# EAGLE schematic B_OTL_PSU_Board_REV_A (EAGLE 9.6.2)
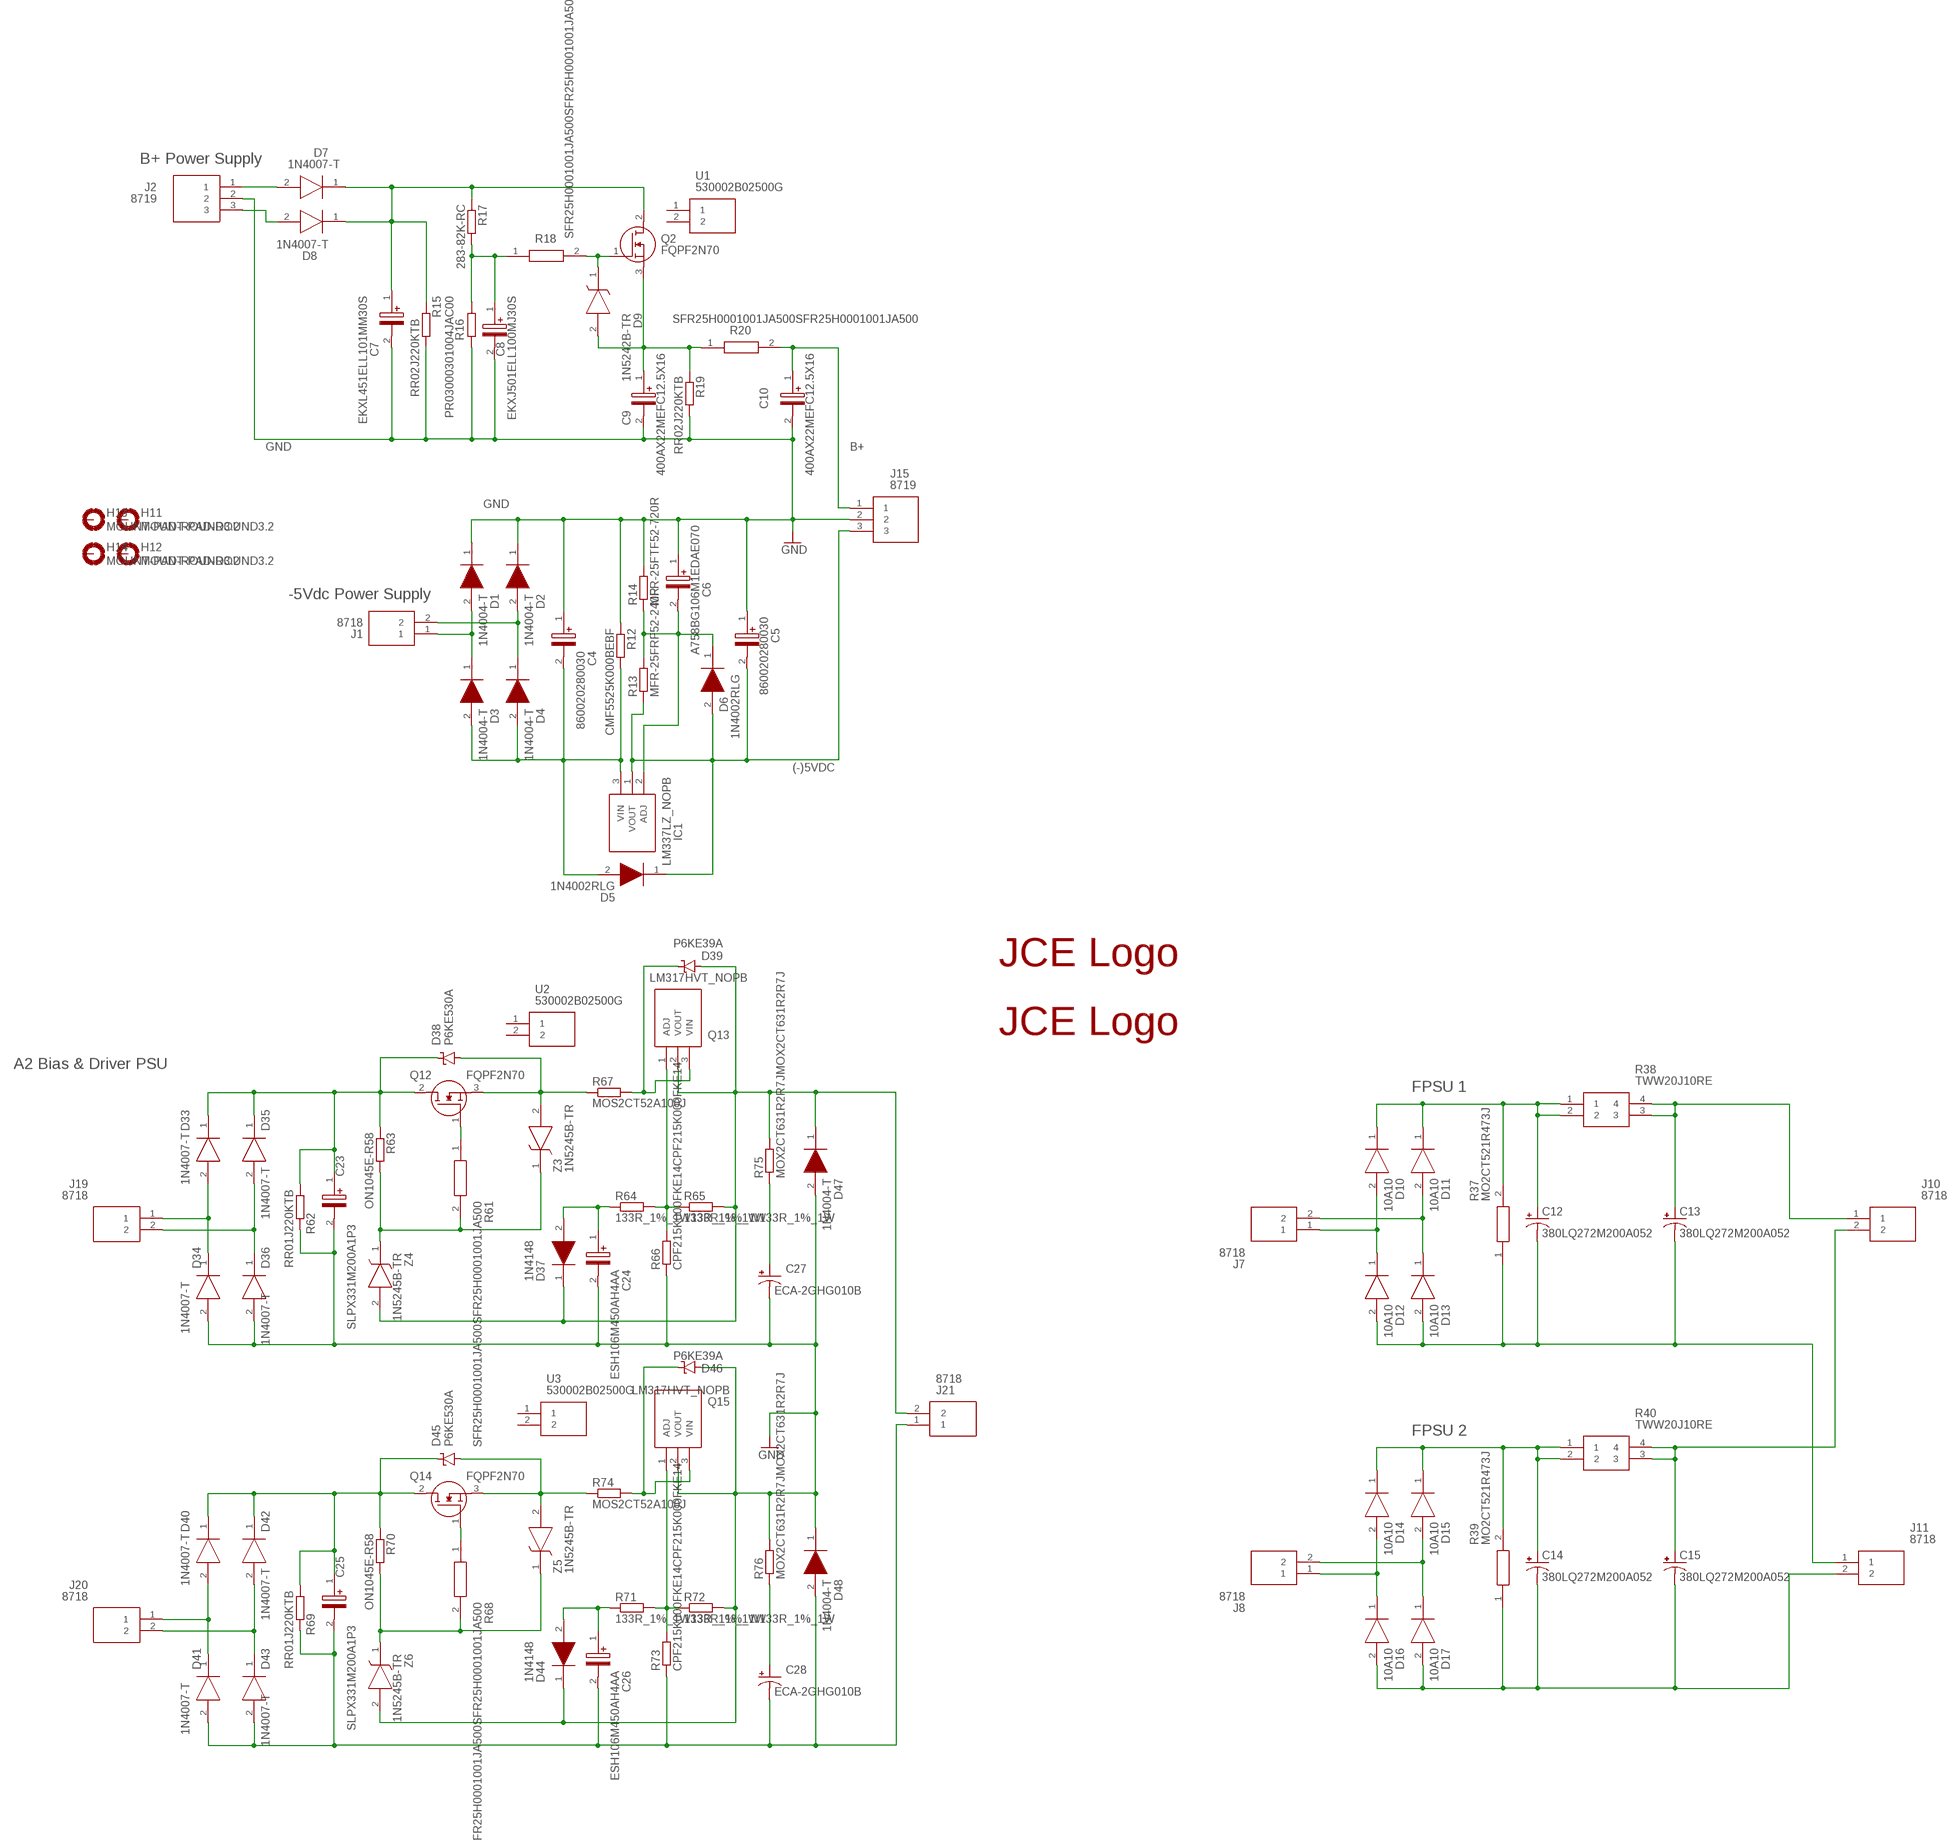
[diagram p0: schematic, sheet 1]

## Parts
C4  860020280030  [CAPPRD750W82D1600H3550]
C5  860020280030  [CAPPRD750W82D1600H3550]
C6  A758BG106M1EDAE070  [CAPPRD200W55D500H800]
C7  EKXL451ELL101MM30S  [CAPPRD750W80D1825H3200]
C8  EKXJ501ELL100MJ30S  [CAPPRD500W60D1025H3150]
C9  400AX22MEFC12.5X16  [CAPPRD500W60D1250H1600]
C10  400AX22MEFC12.5X16  [CAPPRD500W60D1250H1600]
C12  380LQ272M200A052  [CAPPRD1000W210D3550H5200]
C13  380LQ272M200A052  [CAPPRD1000W210D3550H5200]
C14  380LQ272M200A052  [CAPPRD1000W210D3550H5200]
C15  380LQ272M200A052  [CAPPRD1000W210D3550H5200]
C23  SLPX331M200A1P3  [CAPPRD1000W190D2250H2700]
C24  ESH106M450AH4AA  [CAPPRD500W60D1000H2200]
C25  SLPX331M200A1P3  [CAPPRD1000W190D2250H2700]
C26  ESH106M450AH4AA  [CAPPRD500W60D1000H2200]
C27  ECA-2GHG010B  [CAPPRD500W60D630H1120B]
C28  ECA-2GHG010B  [CAPPRD500W60D630H1120B]
D1  1N4004-T  [DIOAD1408W86L464D236]
D2  1N4004-T  [DIOAD1408W86L464D236]
D3  1N4004-T  [DIOAD1408W86L464D236]
D4  1N4004-T  [DIOAD1408W86L464D236]
D5  1N4002RLG  [DIOAD1138W86L465D235B]
D6  1N4002RLG  [DIOAD1138W86L465D235B]
D7  1N4007-T  [DIOAD1408W86L464D236]
D8  1N4007-T  [DIOAD1408W86L464D236]
D9  1N5242B-TR  [DIOAD700W55L350D160B]
D10  10A10  [DIOAD1910W130L885D885B]
D11  10A10  [DIOAD1910W130L885D885B]
D12  10A10  [DIOAD1910W130L885D885B]
D13  10A10  [DIOAD1910W130L885D885B]
D14  10A10  [DIOAD1910W130L885D885B]
D15  10A10  [DIOAD1910W130L885D885B]
D16  10A10  [DIOAD1910W130L885D885B]
D17  10A10  [DIOAD1910W130L885D885B]
D33  1N4007-T  [DIOAD1408W86L464D236]
D34  1N4007-T  [DIOAD1408W86L464D236]
D35  1N4007-T  [DIOAD1408W86L464D236]
D36  1N4007-T  [DIOAD1408W86L464D236]
D37  1N4148  [DIOAD1068W53L380D172]
D38  P6KE530A  [DIOAD1378W86L670D310B]
D39  P6KE39A  [DIOAD1299W88L640D324B]
D40  1N4007-T  [DIOAD1408W86L464D236]
D41  1N4007-T  [DIOAD1408W86L464D236]
D42  1N4007-T  [DIOAD1408W86L464D236]
D43  1N4007-T  [DIOAD1408W86L464D236]
D44  1N4148  [DIOAD1068W53L380D172]
D45  P6KE530A  [DIOAD1378W86L670D310B]
D46  P6KE39A  [DIOAD1299W88L640D324B]
D47  1N4004-T  [DIOAD1408W86L464D236]
D48  1N4004-T  [DIOAD1408W86L464D236]
H11  MOUNT-PAD-ROUND3.2  [3,2-PAD]
H12  MOUNT-PAD-ROUND3.2  [3,2-PAD]
H13  MOUNT-PAD-ROUND3.2  [3,2-PAD]
H14  MOUNT-PAD-ROUND3.2  [3,2-PAD]
IC1  LM337LZ_NOPB  [LM337LZNOPB]
J1  8718  [SHDR2W99P0X500_1X2_1001X762X10]
J2  8719  [8719]
J7  8718  [SHDR2W99P0X500_1X2_1001X762X10]
J8  8718  [SHDR2W99P0X500_1X2_1001X762X10]
J10  8718  [SHDR2W99P0X500_1X2_1001X762X10]
J11  8718  [SHDR2W99P0X500_1X2_1001X762X10]
J15  8719  [8719]
J19  8718  [SHDR2W99P0X500_1X2_1001X762X10]
J20  8718  [SHDR2W99P0X500_1X2_1001X762X10]
J21  8718  [SHDR2W99P0X500_1X2_1001X762X10]
Q2  FQPF2N70  [TO254P490X1016X1977-3P]
Q12  FQPF2N70  [TO254P490X1016X1977-3P]
Q13  LM317HVT_NOPB  [TO254P470X1028X1955-3P]
Q14  FQPF2N70  [TO254P490X1016X1977-3P]
Q15  LM317HVT_NOPB  [TO254P470X1028X1955-3P]
R12  CMF5525K000BEBF  [RESAD999W69L610D229B]
R13  MFR-25FRF52-240R  [RESAD1000W60L630D230B]
R14  MFR-25FTF52-720R  [RESAD1000W60L630D230B]
R15  RR02J220KTB  [RESAD1630W90L900D350B]
R16  PR03000301004JAC00  [RESAD2276W63L1950D520B]
R17  283-82K-RC  [RESAD1950W75L1600D550B]
R18  SFR25H0001001JA500SFR25H0001001JA500  [RESAD1076W63L700D250B]
R19  RR02J220KTB  [RESAD1630W90L900D350B]
R20  SFR25H0001001JA500SFR25H0001001JA500  [RESAD1076W63L700D250B]
R37  MO2CT521R473J  [RESAD3950W80L1550D600]
R38  TWW20J10RE  [TWW20J10RE]
R39  MO2CT521R473J  [RESAD3950W80L1550D600]
R40  TWW20J10RE  [TWW20J10RE]
R61  SFR25H0001001JA500SFR25H0001001JA500  [RESAD1076W63L700D250B]
R62  RR01J220KTB  [RESAD1110W65L680D260B]
R63  ON1045E-R58  [ON1045E-R58]
R64  133R_1%_1W133R_1%_1W  [RESAD1560W50L1230D250B]
R65  133R_1%_1W133R_1%_1W  [RESAD1560W50L1230D250B]
R66  CPF215K000FKE14CPF215K000FKE14  [RESAD1683W81L1080D368B]
R67  MOS2CT52A100J  [RESAD1660W80L1200D400B]
R68  SFR25H0001001JA500SFR25H0001001JA500  [RESAD1076W63L700D250B]
R69  RR01J220KTB  [RESAD1110W65L680D260B]
R70  ON1045E-R58  [ON1045E-R58]
R71  133R_1%_1W133R_1%_1W  [RESAD1560W50L1230D250B]
R72  133R_1%_1W133R_1%_1W  [RESAD1560W50L1230D250B]
R73  CPF215K000FKE14CPF215K000FKE14  [RESAD1683W81L1080D368B]
R74  MOS2CT52A100J  [RESAD1660W80L1200D400B]
R75  MOX2CT631R2R7JMOX2CT631R2R7J  [RESAD2010W80L1550D650B]
R76  MOX2CT631R2R7JMOX2CT631R2R7J  [RESAD2010W80L1550D650B]
SYM1  JCE_SMALLSMALL  [JCE_SMALL]
SYM2  JCE  [JCE]
U1  530002B02500G  [529802B02500G]
U2  530002B02500G  [529802B02500G]
U3  530002B02500G  [529802B02500G]
Z3  1N5245B-TR  [DIOAD990W55L350D160]
Z4  1N5245B-TR  [DIOAD990W55L350D160]
Z5  1N5245B-TR  [DIOAD990W55L350D160]
Z6  1N5245B-TR  [DIOAD990W55L350D160]

## Nets
(+)FPSU_1: C13.1(+) J10.1 R38.3 R38.4
(+)FPSU_2: C15.1(+) J10.2 R40.3 R40.4
(-)5VDC: C5.2(-) D5.1(K) D6.2(A) IC1.1(VOUT) J15.3 R13.1
(-)FPSU_1: C12.2(-) C13.2(-) D12.2(A) D13.2(A) J11.1 R37.1
(-)FPSU_2: C14.2(-) C15.2(-) D16.2(A) D17.2(A) J11.2 R39.1
B+: C10.1(+) J15.1 R20.2
GND: C4.1(+) C5.1(+) C6.1(+) C7.2(-) C8.2(-) C9.2(-) C10.2(-) C23.2(-) C24.2(-) C27.2(-) D1.1(K) D2.1(K) D34.2(A) D36.2(A) D44.1(K) D46.2(A) D47.2(A) D48.1(K) J2.2 J15.2 Q15.2(VOUT) R12.1 R14.2 R15.2 R16.2 R19.2 R62.2 R66.1 R72.2 R76.2 Z6.2(A)
N$1: D33.2(A) D34.1(K) J19.1
N$2: C23.1(+) D33.1(K) D35.1(K) D38.1(C) Q12.2(D) R62.1 R63.1
N$4: D35.2(A) D36.1(K) J19.2
N$5: C24.1(+) D37.2(A) R64.1
N$6: Q12.1(G) R61.1
N$7: R61.2 R63.2 Z3.1(K) Z4.1(K)
N$8: D38.2(A) Q12.3(S) R67.1 Z3.2(A)
N$9: D39.1(C) Q13.3(VIN) R67.2
N$10: D1.2(A) D3.1(K) J1.1
N$13: Q13.1(ADJ) R64.2 R65.1 R66.2
N$16: D2.2(A) D4.1(K) J1.2
N$17: D7.2(A) J2.1
N$18: C4.2(-) D3.2(A) D4.2(A) D5.2(A) IC1.3(VIN) R12.2
N$19: C6.2(-) D6.1(K) IC1.2(ADJ) R13.2 R14.1
N$20: D8.2(A) J2.3
N$21: C7.1(+) D7.1(K) D8.1(K) Q2.2(D) R15.1 R17.1
N$22: C8.1(+) R16.1 R17.2 R18.1
N$23: C25.1(+) D40.1(K) D42.1(K) D45.1(C) Q14.2(D) R69.1 R70.1
N$24: D9.1(K) Q2.1(G) R18.2
N$25: C9.1(+) D9.2(A) Q2.3(S) R19.1 R20.1
N$32: C26.1(+) D44.2(A) R71.1
N$38: Q15.1(ADJ) R71.2 R72.1 R73.2
N$42: Q14.1(G) R68.1
N$45: R68.2 R70.2 Z5.1(K) Z6.1(K)
N$49: D45.2(A) Q14.3(S) R74.1 Z5.2(A)
N$54: D46.1(C) Q15.3(VIN) R74.2
N$58: C12.1(+) D10.1(K) D11.1(K) R37.2 R38.1 R38.2
N$61: D11.2(A) D13.1(K) J7.2
N$62: D10.2(A) D12.1(K) J7.1
N$63: C14.1(+) D14.1(K) D15.1(K) R39.2 R40.1 R40.2
N$65: D15.2(A) D17.1(K) J8.2
N$66: D14.2(A) D16.1(K) J8.1
N$87: C28.1(+) R76.1
N$88: D40.2(A) D41.1(K) J20.1
N$89: C27.1(+) R75.1
N$90: D42.2(A) D43.1(K) J20.2
V+: D37.1(K) D39.2(A) D47.1(K) J21.2 Q13.2(VOUT) R65.2 R75.2 Z4.2(A)
V-: C25.2(-) C26.2(-) C28.2(-) D41.2(A) D43.2(A) D48.2(A) J21.1 R69.2 R73.1
Unconnected: H11.B3,2(MOUNT) H12.B3,2(MOUNT) H13.B3,2(MOUNT) H14.B3,2(MOUNT) U1.1 U1.2 U2.1 U2.2 U3.1 U3.2

## Notes on the sheet
- B+ Power Supply
- -5Vdc Power Supply
- A2 Bias & Driver PSU
- FPSU 1
- FPSU 2

## Library data of the parts
C4 C5 = SamacSys_Parts:860020280030: Wurth Elektronik 12000uF 10 V dc Aluminium Electrolytic Capacitor, WCAP-ATG5 Series 2000h 16 (Dia.) x 35.5mm Source: Datasheet; DESCRIPTION: Wurth Elektronik 12000uF 10 V dc Aluminium Electrolytic Capacitor, WCAP-ATG5 Series 2000h 16 (Dia.) x 35.5mm; HEIGHT: 35.5mm; MANUFACTURER_NAME: Wurth Elektronik; MANUFACTURER_PART_NUMBER: 860020280030
C6 = SamacSys_Parts:A758BG106M1EDAE070: Aluminum Organic Polymer Capacitors 25V 10uF 20% ESR= 70mohms Source: Datasheet <https://api.kemet.com/component-edge/download/datasheet/A758BG106M1EDAE070.pdf>; DESCRIPTION: Aluminum Organic Polymer Capacitors 25V 10uF 20% ESR= 70mohms; HEIGHT: 8mm; MANUFACTURER_NAME: Kemet; MANUFACTURER_PART_NUMBER: A758BG106M1EDAE070; MOUSER_PART_NUMBER: 80-A758BG106M1EDAE70; MOUSER_PRICE-STOCK: https://www.mouser.co.uk/ProductDetail/KEMET/A758BG106M1EDAE070?qs=hzBznG4dWXUYIEcEuNBy%252BQ%3D%3D
C7 = SamacSys_Parts:EKXL451ELL101MM30S: Aluminum Electrolytic Capacitors - Radial Leaded 100uF 20% 450V Long Life Source: Datasheet <https://www.mouser.co.uk/datasheet/2/420/United-Chemi-Con-1511408.pdf>; DESCRIPTION: Aluminum Electrolytic Capacitors - Radial Leaded 100uF 20% 450V Long Life; HEIGHT: 32mm; MANUFACTURER_NAME: Chemi-Con; MANUFACTURER_PART_NUMBER: EKXL451ELL101MM30S; MOUSER_PART_NUMBER: 661-EKXL451ELL101MM3; MOUSER_PRICE-STOCK: https://www.mouser.co.uk/ProductDetail/United-Chemi-Con/EKXL451ELL101MM30S?qs=r5DSvlrkXmK%252B3Zyx4Rj%2FlA%3D%3D
C8 = SamacSys_Parts:EKXJ501ELL100MJ30S: Aluminum Electrolytic Capacitors - Radial Leaded 10uF 500V 20% Aluminum Capacitor Source: Datasheet <https://www.mouser.com/datasheet/2/420/113326760852d6c4ba03a36-1218575.pdf>; DESCRIPTION: Aluminum Electrolytic Capacitors - Radial Leaded 10uF 500V 20% Aluminum Capacitor; HEIGHT: 31.5mm; MANUFACTURER_NAME: United Chemi-Con (UCC); MANUFACTURER_PART_NUMBER: EKXJ501ELL100MJ30S; MOUSER_PART_NUMBER: 661-EKXJ501ELL100MJ3
C9 C10 = SamacSys_Parts:400AX22MEFC12.5X16: Aluminium Electrolytic Capacitors - Radial Leaded GENERAL PURPOSE ELECTROLYTIC CAPACITORS Source: Datasheet <https://www.mouser.fr/datasheet/2/977/e_AX-1601119.pdf>; DESCRIPTION: Aluminium Electrolytic Capacitors - Radial Leaded GENERAL PURPOSE ELECTROLYTIC CAPACITORS; HEIGHT: 16mm; MANUFACTURER_NAME: Rubycon; MANUFACTURER_PART_NUMBER: 400AX22MEFC12.5X16; MOUSER_PART_NUMBER: 232-400AX22MEFC125X1; MOUSER_PRICE-STOCK: https://www.mouser.co.uk/ProductDetail/Rubycon/400AX22MEFC125X16?qs=T3oQrply3y%2FIK5H7GYNKdQ%3D%3D
C12-C15 = SamacSys_Parts:380LQ272M200A052: Cornell-Dubilier 2700uF 200 V dc Aluminium Capacitor A05, 380LQ Series 1000 (Shelf) h, 2000 (Endurance) h 35 x 50mm Source: Datasheet; DESCRIPTION: Cornell-Dubilier 2700uF 200 V dc Aluminium Capacitor A05, 380LQ Series 1000 (Shelf) h, 2000 (Endurance) h 35 x 50mm; HEIGHT: 52mm; MANUFACTURER_NAME: Cornell Dubilier; MANUFACTURER_PART_NUMBER: 380LQ272M200A052; MOUSER_PART_NUMBER: 5985-380-200V272; MOUSER_PRICE-STOCK: https://www.mouser.co.uk/ProductDetail/Cornell-Dubilier-CDE/380LQ272M200A052?qs=CL13mIxpkeFZi9XUnm6n7w%3D%3D
C23 C25 = SamacSys_Parts:SLPX331M200A1P3: Cap Aluminum Lytic 330uF 200V 20% (22 X 25mm) Snap-In 10mm 0.603 Ohm 1510mA 3000h 85C Source: Datasheet <https://www.arrow.com/en/products/slpx331m200a1p3/cornell-dubilier-electronics>; DESCRIPTION: Cap Aluminum Lytic 330uF 200V 20% (22 X 25mm) Snap-In 10mm 0.603 Ohm 1510mA 3000h 85C; HEIGHT: 27mm; MANUFACTURER_NAME: Cornell Dubilier; MANUFACTURER_PART_NUMBER: SLPX331M200A1P3
C24 C26 = SamacSys_Parts:ESH106M450AH4AA: KEMET - ESH106M450AH4AA - Electrolytic Capacitor, 10 F, 450 V, ESH Series, +/- 20%, Radial Leaded, 10 mm Source: Datasheet <https://ms.componentsearchengine.com/Datasheets/2/ESH106M450AH4AA.pdf>; DESCRIPTION: KEMET - ESH106M450AH4AA - Electrolytic Capacitor, 10 F, 450 V, ESH Series, +/- 20%, Radial Leaded, 10 mm; HEIGHT: 22mm; MANUFACTURER_NAME: Kemet; MANUFACTURER_PART_NUMBER: ESH106M450AH4AA
C27 C28 = SamacSys_Parts:ECA-2GHG010B: ECA-2GHG010B 1uF 400VDC 105C
D1-D4 D47 D48 = SamacSys_Parts:1N4004-T: Diodes Inc 400V 1A, Diode, 2-Pin DO-41 1N4004-T Source: Datasheet <https://www.diodes.com/assets/Datasheets/ds28002.pdf>; DESCRIPTION: Diodes Inc 400V 1A, Diode, 2-Pin DO-41 1N4004-T; HEIGHT: mm; MANUFACTURER_NAME: Diodes Inc.; MANUFACTURER_PART_NUMBER: 1N4004-T; MOUSER_PART_NUMBER: 621-1N4004; MOUSER_PRICE-STOCK: https://www.mouser.co.uk/ProductDetail/Diodes-Incorporated/1N4004-T/?qs=e%2FRqmsgwm9h5YfUmULbvEw%3D%3D
D5 D6 = SamacSys_Parts:1N4002RLG: Rectifiers 100V 1A Standard
D7 D8 D33-D36 D40-D43 = SamacSys_Parts:1N4007-T: Diode Standard 1A 1000V 1Vf DO41 Diodes Inc 1N4007-T, Switching Diode, 1000V 1A, 2-Pin DO-41 Source: Datasheet; DESCRIPTION: Diode Standard 1A 1000V 1Vf DO41 Diodes Inc 1N4007-T, Switching Diode, 1000V 1A, 2-Pin DO-41; HEIGHT: mm; MANUFACTURER_NAME: Diodes Inc.; MANUFACTURER_PART_NUMBER: 1N4007-T; MOUSER_PART_NUMBER: 621-1N4007; MOUSER_PRICE-STOCK: https://www.mouser.co.uk/ProductDetail/Diodes-Incorporated/1N4007-T?qs=e%2FRqmsgwm9iVtgJYUW23AA%3D%3D
D9 = SamacSys_Parts:1N5242B-TR: Zener Diodes 12 Volt 0.5 Watt
D10-D17 = SamacSys_Parts:10A10
D37 D44 = SamacSys_Parts:1N4148: Small Signal Diode, 100V 0.3A 2-Pin DO35 Source: Datasheet <https://www.onsemi.com/pub/Collateral/1N914A-D.pdf>; DESCRIPTION: Small Signal Diode, 100V 0.3A 2-Pin DO35; HEIGHT: mm; MANUFACTURER_NAME: ON Semiconductor; MANUFACTURER_PART_NUMBER: 1N4148; MOUSER_PART_NUMBER: 512-1N4148; MOUSER_PRICE-STOCK: https://www.mouser.co.uk/ProductDetail/ON-Semiconductor-Fairchild/1N4148?qs=i4Fj9T%2FoRm8RMUhj5DeFQg%3D%3D
D38 D45 = SamacSys_Parts:P6KE530A
D39 D46 = SamacSys_Parts:P6KE39A
H11-H14 = holes:MOUNT-PAD-ROUND: MOUNTING PAD, round
IC1 = SamacSys_Parts:LM337LZ_NOPB: Linear Voltage Regulators 3-Term Adj Reg Source: Datasheet <https://datasheet.lcsc.com/szlcsc/Texas-Instruments-TI-LM337LZ-NOPB_C33082.pdf>; DESCRIPTION: Linear Voltage Regulators 3-Term Adj Reg; HEIGHT: 5.34mm; MANUFACTURER_NAME: Texas Instruments; MANUFACTURER_PART_NUMBER: LM337LZ/NOPB
J1 J7 J8 J10 J11 J19-J21 = SamacSys_Parts:8718: Fixed Terminal Blocks HORIZ. TERM. BLOCK Source: Datasheet <https://www.keyelco.com/product-pdf.cfm?p=14160>; DESCRIPTION: Fixed Terminal Blocks HORIZ. TERM. BLOCK; HEIGHT: 10.01mm; MANUFACTURER_NAME: Keystone Electronics; MANUFACTURER_PART_NUMBER: 8718; MOUSER_PART_NUMBER: 534-8718; MOUSER_PRICE-STOCK: https://www.mouser.co.uk/ProductDetail/Keystone-Electronics/8718?qs=%252BS1bAMbChF8qBANams%2FR5Q%3D%3D
J2 J15 = SamacSys_Parts:8719: Fixed Terminal Blocks HORZ TERM BLK Source: Datasheet; DESCRIPTION: Fixed Terminal Blocks HORZ TERM BLK; HEIGHT: 10mm; MANUFACTURER_NAME: Keystone Electronics; MANUFACTURER_PART_NUMBER: 8719; MOUSER_PART_NUMBER: 534-8719; MOUSER_PRICE-STOCK: https://www.mouser.co.uk/ProductDetail/Keystone-Electronics/8719?qs=%252BS1bAMbChF9%2FI%252B6OdjWLaA%3D%3D
Q2 Q12 Q14 = SamacSys_Parts:FQPF2N70: MOSFET 700V N-Channel Q-FET for A2 driver board Source: Datasheet; DESCRIPTION: MOSFET 700V N-Channel Q-FET for A2 driver board; HEIGHT: 4.9mm; MANUFACTURER_NAME: ON Semiconductor; MANUFACTURER_PART_NUMBER: FQPF2N70
Q13 Q15 = SamacSys_Parts:LM317HVT_NOPB: Texas Instruments LM317 LM317HVT/NOPB, Single Linear Voltage Regulator, 1.5A Adjustable 1.2 57 V, 3-Pin TO-220 Source: Datasheet; DESCRIPTION: Texas Instruments LM317 LM317HVT/NOPB, Single Linear Voltage Regulator, 1.5A Adjustable 1.2 57 V, 3-Pin TO-220; HEIGHT: 4.7mm; MANUFACTURER_NAME: Texas Instruments; MANUFACTURER_PART_NUMBER: LM317HVT/NOPB; MOUSER_PART_NUMBER: 926-LM317HVT/NOPB; MOUSER_PRICE-STOCK: https://www.mouser.co.uk/ProductDetail/Texas-Instruments/LM317HVT-NOPB/?qs=X1J7HmVL2ZFyvDtHey14xA%3D%3D
R12 = SamacSys_Parts:CMF5525K000BEBF: Metal Film Resistors - Through Hole 1/2W 25Kohms .1% Datasheet: Mouser <https://www.mouser.com/datasheet/2/427/cmfind-1762971.pdf>
R13 = SamacSys_Parts:MFR-25FRF52-240R: Metal Film Resistors - Through Hole 240 OHM 1/4W 1%
R14 = SamacSys_Parts:MFR-25FTF52-720R: 720 Ohms - 1 % - Metal Film Resistors - Through Hole - 250 V
R15 R19 = SamacSys_Parts:RR02J220KTB: Metal Film Resistors - Through Hole RR02 5% 220K AMMO
R16 = SamacSys_Parts:PR03000301004JAC00: Metal Film Resistors - Through Hole PR03 5% AC 1M0 -- 750V
R17 = SamacSys_Parts:283-82K-RC: Metal Oxide Resistors 82Kohms 3W 5%Tol -- 350 PPM/C -- 350 V
R18 R20 R61 R68 = SamacSys_Parts:SFR25H0001001JA500: RES 1K OHM 1/2W 5% AXIAL Source: Datasheet <http://www.vishay.com/docs/28722/sfr16s25.pdf>
R37 R39 = SamacSys_Parts:MO2CT521R473J: Metal Oxide Resistors MO2 47K 5%T521 Source: Datasheet <https://ms.componentsearchengine.com/Datasheets/1/MO2CT521R473J.pdf>; DESCRIPTION: Metal Oxide Resistors MO2 47K 5%T521; HEIGHT: mm; MANUFACTURER_NAME: KOA Speer; MANUFACTURER_PART_NUMBER: MO2CT521R473J
R38 R40 = SamacSys_Parts:TWW20J10RE: Wirewound Resistors - Through Hole 10 ohm 20W 5% Ceramic Radial Source: Datasheet; DESCRIPTION: Wirewound Resistors - Through Hole 10 ohm 20W 5% Ceramic Radial; HEIGHT: 46mm; MANUFACTURER_NAME: Ohmite; MANUFACTURER_PART_NUMBER: TWW20J10RE; MOUSER_PART_NUMBER: 588-TWW20J10RE; MOUSER_PRICE-STOCK: https://www.mouser.co.uk/ProductDetail/Ohmite/TWW20J10RE?qs=PzGy0jfpSMvLBlIK6fawmQ%3D%3D
R62 R69 = SamacSys_Parts:RR01J220KTB
R63 R70 = SamacSys_Parts:ON1045E-R58
R64 R65 R71 R72 = SamacSys_Parts:133R_1%_1W
R66 R73 = SamacSys_Parts:CPF215K000FKE14
R67 R74 = SamacSys_Parts:MOS2CT52A100J
R75 R76 = SamacSys_Parts:MOX2CT631R2R7J: MOX2CT631R2R7J 2.7R 2W 5% 200PPM/C
SYM1 = SamacSys_Parts:JCE_SMALL
SYM2 = SamacSys_Parts:JCE
U1-U3 = SamacSys_Parts:530002B02500G: AAVID THERMALLOY - 530002B02500G - HEAT SINK, 2.6K/W, TO-220 Source: Datasheet <https://www.aavid.com/sites/default/files/products/boardlevel/aavid-standard-heatsinks.pdf>; DESCRIPTION: AAVID THERMALLOY - 530002B02500G - HEAT SINK, 2.6K/W, TO-220; HEIGHT: mm; MANUFACTURER_NAME: Aavid Thermalloy; MANUFACTURER_PART_NUMBER: 530002B02500G; MOUSER_PART_NUMBER: 532-530002B02500G; MOUSER_PRICE-STOCK: https://www.mouser.co.uk/ProductDetail/Aavid/530002B02500G/?qs=U7T%2FEnMyvTvnsUSILY5qjg%3D%3D
Z3-Z6 = SamacSys_Parts:1N5245B-TR: Vishay 1N5245B-TR Zener Diode, 15V 5% 0.5 W Through Hole 2-Pin DO-35 Source: Datasheet; DESCRIPTION: Vishay 1N5245B-TR Zener Diode, 15V 5% 0.5 W Through Hole 2-Pin DO-35; HEIGHT: mm; MANUFACTURER_NAME: Vishay; MANUFACTURER_PART_NUMBER: 1N5245B-TR; MOUSER_PART_NUMBER: 78-1N5245B; MOUSER_PRICE-STOCK: https://www.mouser.co.uk/ProductDetail/Vishay-Semiconductors/1N5245B-TR?qs=TNTIDjy6APo%252BlQLkobTvQg%3D%3D